# Altium schematic sheet 100-678-02-00 CIB.SchDoc: Cell Interconnect Board
size B; DrawnBy: RK; DocumentNumber: 100-678-02-00; Revision: 02-00; PageSetup: Record=PageOptions|CenterHorizontal=True|CenterVertical=True|PrintScale=1.10|XCorrection=1.00|YCorrection=1.00|PrintKind=0|BorderSize=5000000|LeftOffset=0|BottomOffset=0|Orientation=2|PaperLength=1000|PaperWidth=1000|Scale=100|PaperSource=7|PrintQuality=-4|MediaType=1|DitherType=10|PaperKind=Tabloid|PrintScaleMode=1
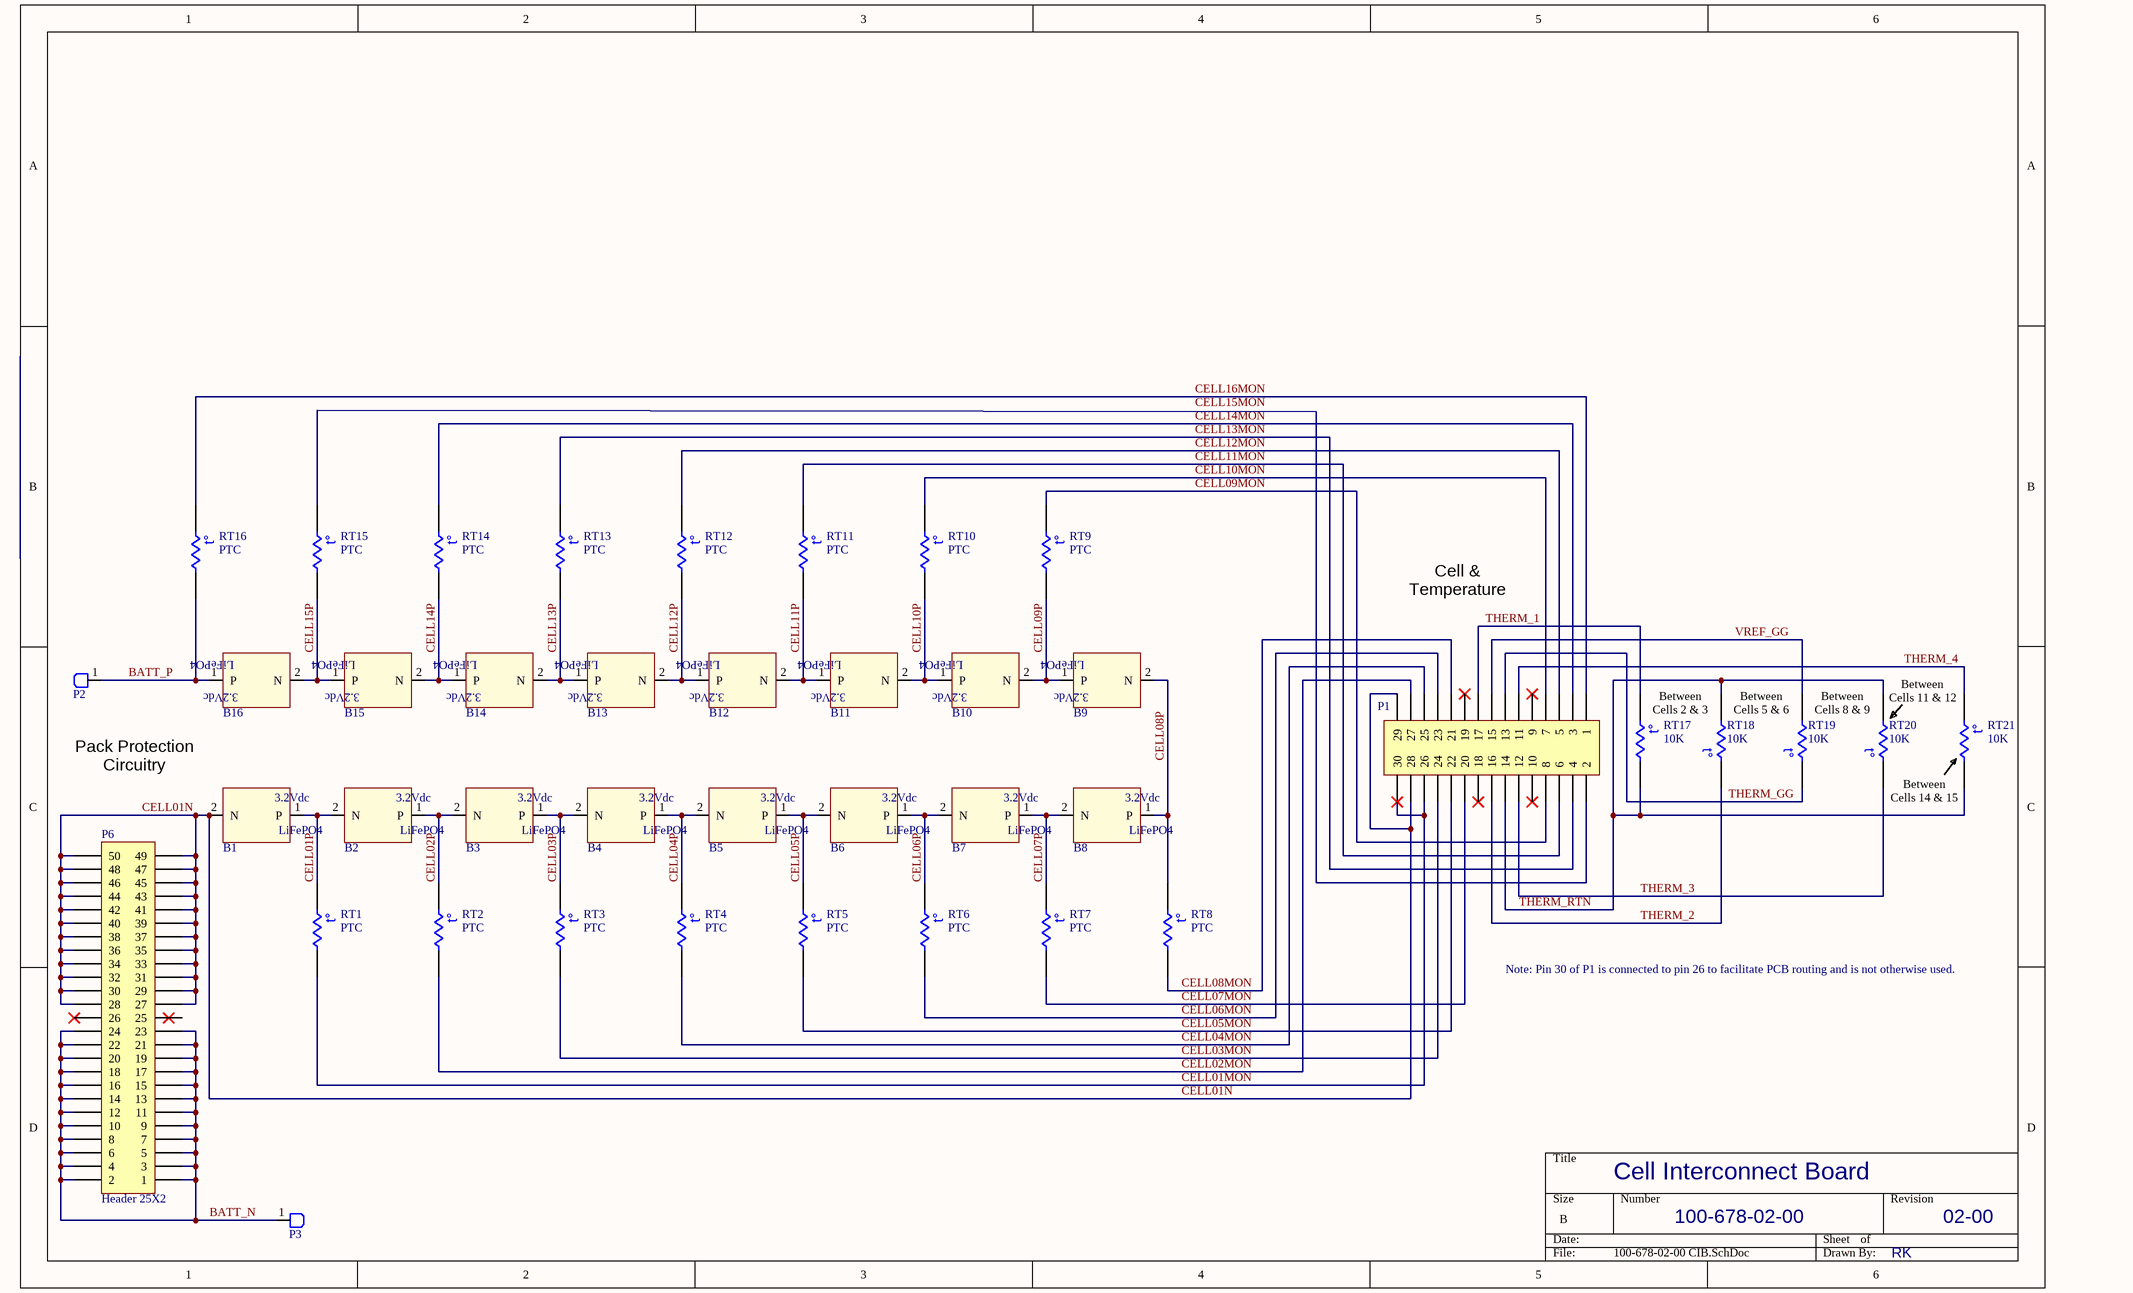
[diagram p0: 100-678-02-00 CIB.SchDoc]

## Parts
B1  TENERGY 30209 LiFePO4 Cell  [TENERGY 30209 LiFePO4 Cell]  (value not drawn)  (no BOM)
B2  TENERGY 30209 LiFePO4 Cell  [TENERGY 30209 LiFePO4 Cell]  (value not drawn)  (no BOM)
B3  TENERGY 30209 LiFePO4 Cell  [TENERGY 30209 LiFePO4 Cell]  (value not drawn)  (no BOM)
B4  TENERGY 30209 LiFePO4 Cell  [TENERGY 30209 LiFePO4 Cell]  (value not drawn)  (no BOM)
B5  TENERGY 30209 LiFePO4 Cell  [TENERGY 30209 LiFePO4 Cell]  (value not drawn)  (no BOM)
B6  TENERGY 30209 LiFePO4 Cell  [TENERGY 30209 LiFePO4 Cell]  (value not drawn)  (no BOM)
B7  TENERGY 30209 LiFePO4 Cell  [TENERGY 30209 LiFePO4 Cell]  (value not drawn)  (no BOM)
B8  TENERGY 30209 LiFePO4 Cell  [TENERGY 30209 LiFePO4 Cell]  (value not drawn)  (no BOM)
B9  TENERGY 30209 LiFePO4 Cell  [TENERGY 30209 LiFePO4 Cell]  (value not drawn)  (no BOM)
B10  TENERGY 30209 LiFePO4 Cell  [TENERGY 30209 LiFePO4 Cell]  (value not drawn)  (no BOM)
B11  TENERGY 30209 LiFePO4 Cell  [TENERGY 30209 LiFePO4 Cell]  (value not drawn)  (no BOM)
B12  TENERGY 30209 LiFePO4 Cell  [TENERGY 30209 LiFePO4 Cell]  (value not drawn)  (no BOM)
B13  TENERGY 30209 LiFePO4 Cell  [TENERGY 30209 LiFePO4 Cell]  (value not drawn)  (no BOM)
B14  TENERGY 30209 LiFePO4 Cell  [TENERGY 30209 LiFePO4 Cell]  (value not drawn)  (no BOM)
B15  TENERGY 30209 LiFePO4 Cell  [TENERGY 30209 LiFePO4 Cell]  (value not drawn)  (no BOM)
B16  TENERGY 30209 LiFePO4 Cell  [TENERGY 30209 LiFePO4 Cell]  (value not drawn)  (no BOM)
P1  Header 15X2  [CONN 2X15 SKT TH]  (value not drawn)
P2  CONN TAB MALE 1/4" PC TH  [TERM, LUG, RING TONGUE, #8-32 W/ PEM]  (value not drawn)
P3  CONN TAB MALE 1/4" PC TH  [TERM, LUG, RING TONGUE, #8-32 W/ PEM]  (value not drawn)
P6  Header 25X2  [CONN 2X25 SKT TH]
RT1  PTC  [THERM 1812]
RT2  PTC  [THERM 1812]
RT3  PTC  [THERM 1812]
RT4  PTC  [THERM 1812]
RT5  PTC  [THERM 1812]
RT6  PTC  [THERM 1812]
RT7  PTC  [THERM 1812]
RT8  PTC  [THERM 1812]
RT9  PTC  [THERM 1812]
RT10  PTC  [THERM 1812]
RT11  PTC  [THERM 1812]
RT12  PTC  [THERM 1812]
RT13  PTC  [THERM 1812]
RT14  PTC  [THERM 1812]
RT15  PTC  [THERM 1812]
RT16  PTC  [THERM 1812]
RT17  10K  [THERMISTOR JT]
RT18  10K  [THERMISTOR JT]
RT19  10K  [THERMISTOR JT]
RT20  10K  [THERMISTOR JT]
RT21  10K  [THERMISTOR JT]

## Nets
BATT_N: P3.1 P6.1 P6.2 P6.3 P6.4 P6.5 P6.6 P6.7 P6.8 P6.9 P6.10 P6.11 P6.12 P6.13 P6.14 P6.15 P6.16 P6.17 P6.18 P6.19 P6.20 P6.21 P6.22 P6.23 P6.24
BATT_P: B16.1(P) P2.1 RT16.2
CELL01MON: P1.26 P1.30 RT1.2
CELL01N: B1.2(N) P1.28 P1.29 P6.27 P6.28 P6.29 P6.30 P6.31 P6.32 P6.33 P6.34 P6.35 P6.36 P6.37 P6.38 P6.39 P6.40 P6.41 P6.42 P6.43 P6.44 P6.45 P6.46 P6.47 P6.48 P6.49 P6.50
CELL01P: B1.1(P) B2.2(N) RT1.1
CELL02MON: P1.27 RT2.2
CELL02P: B2.1(P) B3.2(N) RT2.1
CELL03MON: P1.24 RT3.2
CELL03P: B3.1(P) B4.2(N) RT3.1
CELL04MON: P1.25 RT4.2
CELL04P: B4.1(P) B5.2(N) RT4.1
CELL05MON: P1.22 RT5.2
CELL05P: B5.1(P) B6.2(N) RT5.1
CELL06MON: P1.23 RT6.2
CELL06P: B6.1(P) B7.2(N) RT6.1
CELL07MON: P1.20 RT7.2
CELL07P: B7.1(P) B8.2(N) RT7.1
CELL08MON: P1.21 RT8.2
CELL08P: B8.1(P) B9.2(N) RT8.1
CELL09MON: P1.8 RT9.1
CELL09P: B9.1(P) B10.2(N) RT9.2
CELL10MON: P1.7 RT10.1
CELL10P: B10.1(P) B11.2(N) RT10.2
CELL11MON: P1.6 RT11.1
CELL11P: B11.1(P) B12.2(N) RT11.2
CELL12MON: P1.5 RT12.1
CELL12P: B12.1(P) B13.2(N) RT12.2
CELL13MON: P1.4 RT13.1
CELL13P: B13.1(P) B14.2(N) RT13.2
CELL14MON: P1.3 RT14.1
CELL14P: B14.1(P) B15.2(N) RT14.2
CELL15P: B15.1(P) B16.2(N) RT15.2
CELL16MON: P1.1 RT16.1
THERM_1: P1.17 RT17.1
THERM_2: P1.16 RT18.1
THERM_3: P1.12 RT20.1
THERM_4: P1.11 RT21.1
THERM_GG: P1.13 RT19.1
THERM_RTN: P1.14 RT17.2 RT18.2 RT20.2 RT21.2
VREF_GG: P1.15 RT19.2
NetP1_2: P1.2 RT15.1

Not connected (* = marked no-connect by the designer): P1 9* 10* 18* 19*; P6 25 26*

## Notes on the sheet
- Cell & Temperature
  Monitoring Conn.
- Between
  Cells 11 & 12
- Between
  Cells 2 & 3
- Between
  Cells 5 & 6
- Between
  Cells 8 & 9
- (near B1) Pack Protection
  Circuitry
  Connector
- Between
  Cells 14 & 15
- Note: Pin 30 of P1 is connected to pin 26 to facilitate PCB routing and is not otherwise used.
- Labels drawn without touching a wire or pin: CELL15MON
- (in symbol Res Thermal) t°
- (in symbol TENERGY 30209 LiFePO4 Cell) 3.2Vdc; LiFePO4

## Library data of the parts
P1 = Header 15X2: CONN, SKT, 15 X 2, 0.1" CTRS, TH, 0.435" HEIGHT GOLD; Manufacturer: SAMTEC; Manufacturer Part Number: ESQ-115-13-L-D; Description: CONN, SKT, 2X15P, 0.1" CTRS, TH, 0.435" HEIGHT GOLD; Pitch Spacing: 2.54; No. of Rows: 2; No. of Contacts: 30; Gender: Receptacle; Contact Termination: Through Hole Vertical; LatestRevisionDate: 17-Jul-2002; LatestRevisionNote: Re-released for DXP Platform.; Publisher: Altium Limited; Supplier 1: Newark; Supplier Part Number 1: 83T8116; RoHS: YES; Stock 1: 100; Pricing 1: 1=5.61, 10=4.91, 100=4.17, 500=3.57, 1000=3.09, 5000=2.76, 10000=2.64 (USD); Series: ESQ; Contact Plating: Gold; Contact Material: Phosphor Bronze; ComponentLink1URL: http://www.farnell.com/datasheets/1596098.pdf; ComponentLink1Description: http://www.farnell.com/datasheets/1596098.pdf
P2 P3 = CONN TAB MALE 1/4" PC TH: NUT PEM 8-32 0.25" HOLE; Manufacturer: PennEngineering; Manufacturer Part Number: KFS2-832
P6 = Header 25X2: CONN, SKT, 25 X 2, 0.1" CTRS, TH, 0.435" HEIGHT GOLD; Manufacturer: SAMTEC; Manufacturer Part Number: ESQ-125-13-L-D; Description: CONN, SKT, 2X15P, 0.1" CTRS, TH, 0.435" HEIGHT GOLD; Pitch Spacing: 2.54; No. of Rows: 2; No. of Contacts: 50; Gender: Receptacle; Contact Termination: Through Hole Vertical; LatestRevisionDate: 17-Jul-2002; LatestRevisionNote: Re-released for DXP Platform.; Publisher: Altium Limited; Supplier 1: Newark; Supplier Part Number 1: 84T3127; RoHS: YES; Stock 1: 100; Pricing 1: 1=7.65, 10=6.83, 100=6.08, 250=5.32, 500=4.84, 1000=4.46, 5000=4.26 (USD); Series: ESQ; Contact Plating: Gold; Contact Material: Phosphor Bronze; ComponentLink1URL: http://www.farnell.com/datasheets/1596098.pdf; ComponentLink1Description: http://www.farnell.com/datasheets/1596098.pdf; Footprint Library: STEM_PCB.PcbLib; Package / Case: Through Hole Vertical
RT1-RT16 = Res Thermal: PTC 2.00A 8VDC RESETTABLE 1812L; Manufacturer: Littelfuse Inc; Manufacturer Part Number: 1812L200THPR; Current - Hold (Ih) (Max): 2A; Current - Trip (It): 3.5A; Current - Max: 100A; Voltage - Max: 8V; R Min/Max: 0.020 ~ 0.060 Ohm; Time to Trip: 2s; Supplier 1: Digi-Key; Supplier Part Number 1: F3375CT-ND; RoHS: RoHS Compliant; Category: Circuit Protection; Stock 1: 3790; Pricing 1: 1=0.55, 10=0.518, 25=0.4772, 50=0.4364, 100=0.3627, 250=0.32972, 500=0.27946, 1000=0.24649 (USD); Package / Case: 1812 (4532 Metric), Concave; Packaging: Cut Tape (CT); ComponentLink1URL: http://www.littelfuse.com/data/en/Data_Sheets/Littelfuse_PTC_1812L.pdf; ComponentLink1Description: http://www.littelfuse.com/data/en/Data_Sheets/Littelfuse_PTC_1812L.pdf; Footprint Library: STEM_PCB.PcbLib
RT17-RT21 = Res Thermal: THERMISTOR NTC 10K B3435 TF 100MM; Manufacturer Part Number: 103JT-100; Manufacturer: Semitec; Supplier Part Number 1: 954-103JT-100; Supplier 1: Mouser